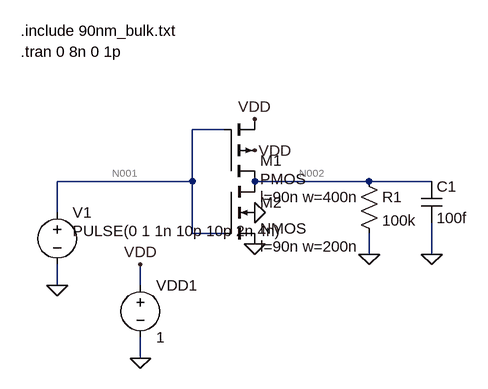
[diagram p0: schematic Draft1.asc]
Draft1.asc, the LTspice schematic file:
Version 4
SHEET 1 880 680
WIRE 368 288 320 288
WIRE 320 368 320 288
WIRE 320 368 112 368
WIRE 592 368 416 368
WIRE 688 368 592 368
WIRE 112 416 112 368
WIRE 320 448 320 368
WIRE 368 448 320 448
WIRE 592 480 592 448
WIRE 688 480 688 432
WIRE 112 528 112 496
WIRE 240 528 240 496
WIRE 240 640 240 608
FLAG 416 464 0
FLAG 416 416 0
FLAG 592 480 0
FLAG 688 480 0
FLAG 416 272 VDD
FLAG 240 496 VDD
FLAG 416 320 VDD
FLAG 112 528 0
FLAG 240 640 0
SYMBOL pmos4 368 368 M180
WINDOW 3 56 4 Left 2
WINDOW 123 56 -24 Left 2
SYMATTR InstName M1
SYMATTR Value2 l=90n w=400n
SYMBOL nmos4 368 368 R0
WINDOW 123 56 100 Left 2
SYMATTR InstName M2
SYMATTR Value2 l=90n w=200n
SYMBOL voltage 112 400 R0
WINDOW 3 24 44 Left 2
WINDOW 123 0 0 Left 0
WINDOW 39 24 124 Left 2
SYMATTR InstName V1
SYMATTR Value PULSE(0 1 1n 10p 10p 2n 4n)
SYMBOL voltage 240 512 R0
WINDOW 123 0 0 Left 0
WINDOW 39 0 0 Left 0
SYMATTR InstName VDD1
SYMATTR Value 1
SYMBOL res 576 352 R0
SYMATTR InstName R1
SYMATTR Value 100k
SYMBOL cap 672 368 R0
SYMATTR InstName C1
SYMATTR Value 100f
TEXT 56 136 Left 2 !.include 90nm_bulk.txt
TEXT 56 168 Left 2 !.tran 0 8n 0 1p

The netlist it stands for:
* Draft1.asc
M1 N002 N001 VDD VDD PMOS l=90n w=400n
M2 N002 N001 0 0 NMOS l=90n w=200n
V1 N001 0 PULSE(0 1 1n 10p 10p 2n 4n)
VDD1 VDD 0 1
R1 N002 0 100k
C1 N002 0 100f
.model NMOS NMOS
.model PMOS PMOS
.lib standard.mos
.include 90nm_bulk.txt
.tran 0 8n 0 1p
.backanno
.end

* Results of the author's LTspice run, read from the files saved beside the schematic
* Operating Point, zero values left out:
*   V(n002) = 972.5 mV
*   V(vdd) = 1 V
*   Id(M2) = 4.875 nA
*   Ig(M2) = -107.7 pA
*   Is(M2) = -4.766 nA
*   Id(M1) = -9.73 µA
*   Ig(M1) = -2.738 pA
*   Is(M1) = 9.73 µA
*   I(R1) = 9.725 µA
*   I(Vdd1) = -9.73 µA
*   I(V1) = 110.4 pA
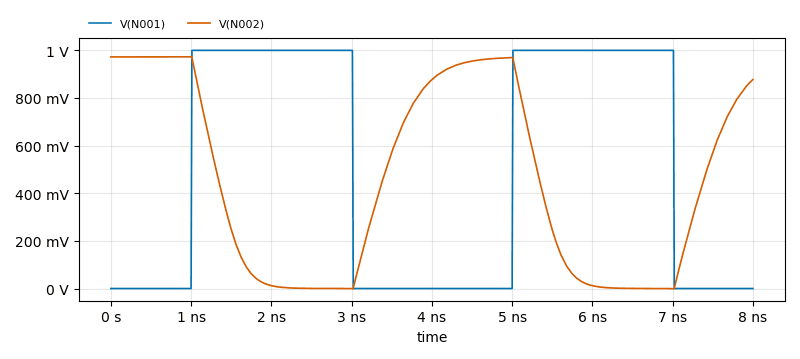
[diagram p1: Transient Analysis of Draft1.asc, plotted from the saved traces]
* Transient Analysis, 1 run:
*   V(N001): min 0 V, max 1 V, average 502.5 mV, rms 708.3 mV, last 0 V
*   V(N002): min -1.179 mV, max 974 mV, average 455.7 mV, rms 607.4 mV, last 877.4 mV